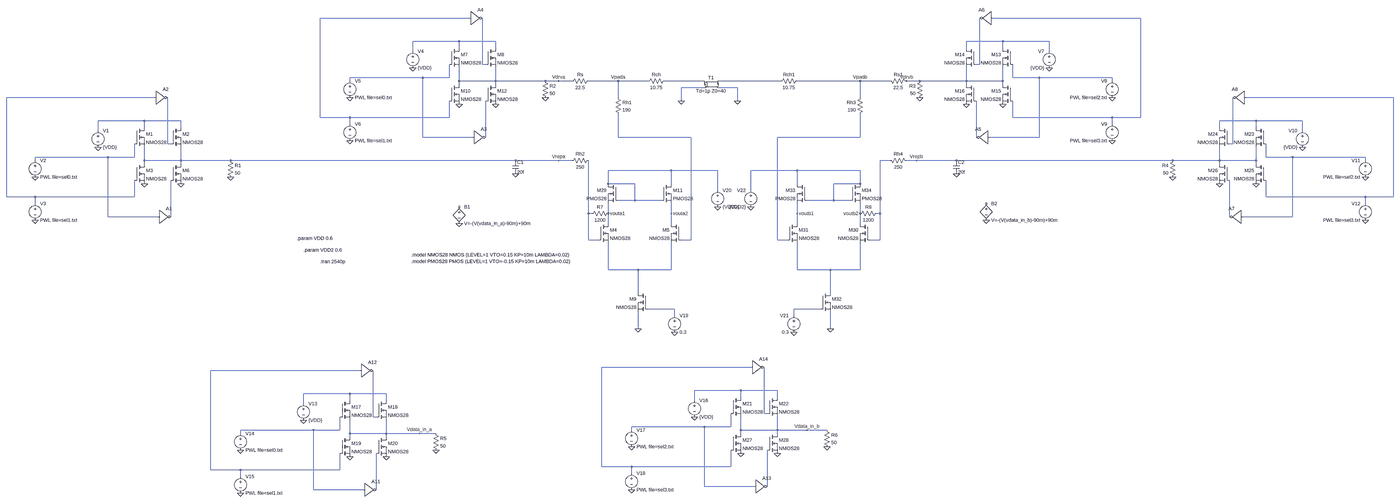
[diagram p0: schematic nvidia_pam3.asc, whole sheet]
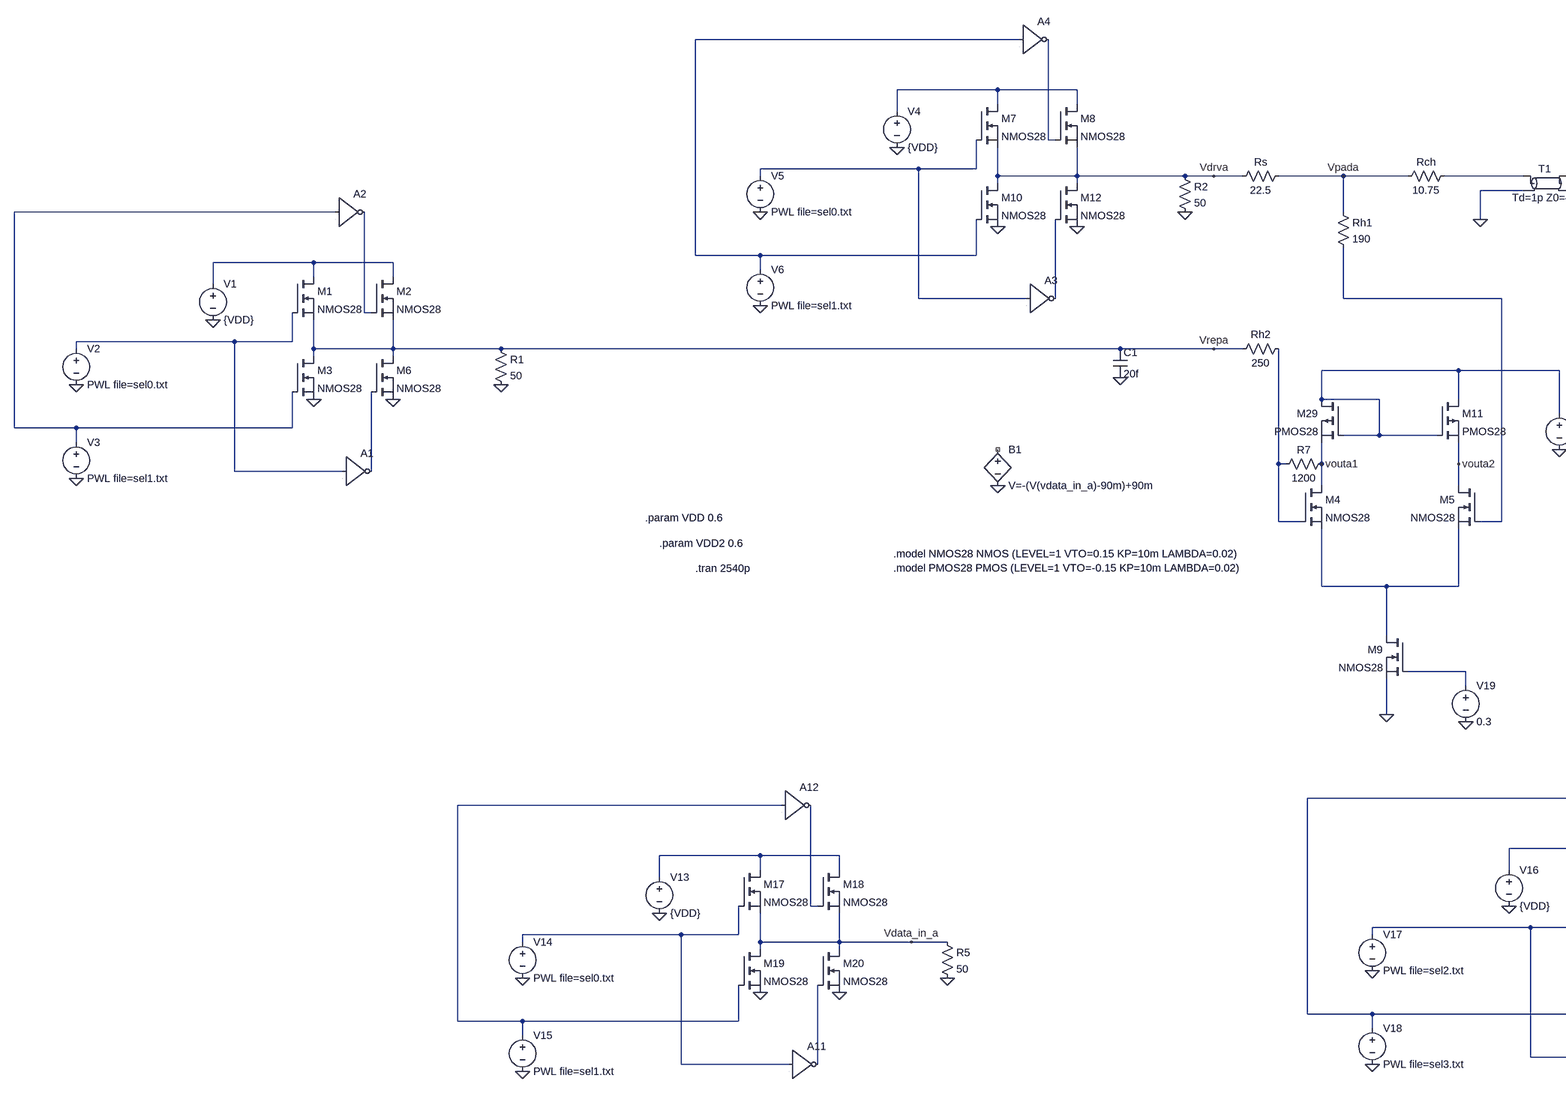
[diagram p1: schematic nvidia_pam3.asc, part, row 1 of 1, column 1 of 2]
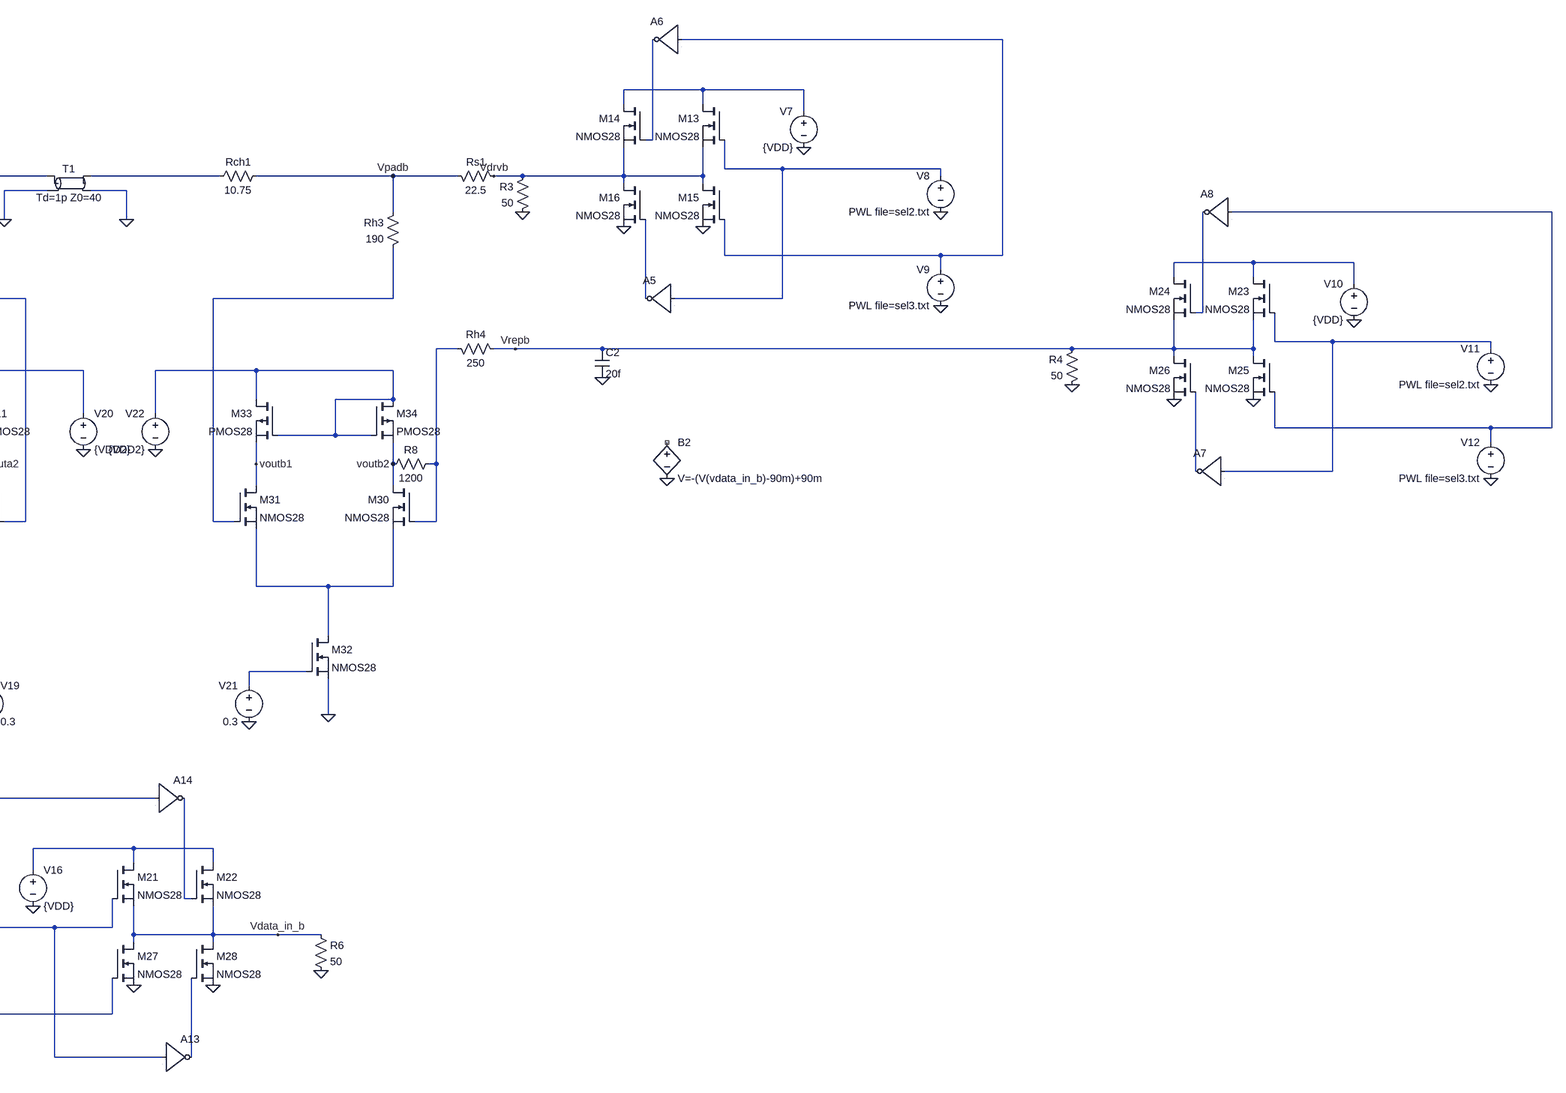
[diagram p2: schematic nvidia_pam3.asc, part, row 1 of 1, column 2 of 2]
nvidia_pam3.asc, the LTspice schematic file:
Version 4
SHEET 1 12048 3124
WIRE -176 -224 -896 -224
WIRE 3088 -224 2368 -224
WIRE -224 -112 -448 -112
WIRE -48 -112 -224 -112
WIRE 2416 -112 2240 -112
WIRE 2640 -112 2416 -112
WIRE -224 -80 -224 -112
WIRE -48 -80 -48 -112
WIRE 2240 -80 2240 -112
WIRE 2416 -80 2416 -112
WIRE -448 -64 -448 -112
WIRE 2640 -64 2640 -112
WIRE -112 0 -112 -224
WIRE -96 0 -112 0
WIRE 2304 0 2304 -224
WIRE 2304 0 2288 0
WIRE -400 64 -752 64
WIRE -272 64 -272 0
WIRE -272 64 -400 64
WIRE 2464 64 2464 0
WIRE 2592 64 2464 64
WIRE 2944 64 2592 64
WIRE -752 80 -752 64
WIRE -224 80 -224 16
WIRE -48 80 -48 16
WIRE -48 80 -224 80
WIRE 192 80 -48 80
WIRE 256 80 192 80
WIRE 320 80 256 80
WIRE 544 80 400 80
WIRE 688 80 544 80
WIRE 944 80 768 80
WIRE 1328 80 1040 80
WIRE 1712 80 1408 80
WIRE 1856 80 1712 80
WIRE 2000 80 1936 80
WIRE 2240 80 2240 16
WIRE 2240 80 2000 80
WIRE 2416 80 2416 16
WIRE 2416 80 2240 80
WIRE 2944 80 2944 64
WIRE -224 96 -224 80
WIRE -48 96 -48 80
WIRE 2240 96 2240 80
WIRE 2416 96 2416 80
WIRE 944 112 848 112
WIRE 1120 112 1040 112
WIRE -1696 160 -2416 160
WIRE 544 160 544 80
WIRE 1712 160 1712 80
WIRE 4624 160 3904 160
WIRE 848 176 848 112
WIRE 1120 176 1120 112
WIRE -896 256 -896 -224
WIRE -752 256 -896 256
WIRE -272 256 -272 176
WIRE -272 256 -752 256
WIRE 2464 256 2464 176
WIRE 2944 256 2464 256
WIRE 3088 256 3088 -224
WIRE 3088 256 2944 256
WIRE -1744 272 -1968 272
WIRE -1568 272 -1744 272
WIRE 3952 272 3776 272
WIRE 4176 272 3952 272
WIRE -752 288 -752 256
WIRE 2944 288 2944 256
WIRE -1744 304 -1744 272
WIRE -1568 304 -1568 272
WIRE 3776 304 3776 272
WIRE 3952 304 3952 272
WIRE -1968 320 -1968 272
WIRE 4176 320 4176 272
WIRE -400 352 -400 64
WIRE -160 352 -400 352
WIRE -96 352 -96 176
WIRE 544 352 544 240
WIRE 896 352 544 352
WIRE 1712 352 1712 240
WIRE 1712 352 1312 352
WIRE 2288 352 2288 176
WIRE 2592 352 2592 64
WIRE 2592 352 2352 352
WIRE -1632 384 -1632 160
WIRE -1616 384 -1632 384
WIRE 3840 384 3840 160
WIRE 3840 384 3824 384
WIRE -1920 448 -2272 448
WIRE -1792 448 -1792 384
WIRE -1792 448 -1920 448
WIRE 4000 448 4000 384
WIRE 4128 448 4000 448
WIRE 4480 448 4128 448
WIRE -2272 464 -2272 448
WIRE -1744 464 -1744 400
WIRE -1568 464 -1568 400
WIRE -1568 464 -1744 464
WIRE -1328 464 -1568 464
WIRE 48 464 -1328 464
WIRE 256 464 48 464
WIRE 320 464 256 464
WIRE 1856 464 1808 464
WIRE 1984 464 1936 464
WIRE 2192 464 1984 464
WIRE 3536 464 2192 464
WIRE 3776 464 3776 400
WIRE 3776 464 3536 464
WIRE 3952 464 3952 400
WIRE 3952 464 3776 464
WIRE 4480 464 4480 448
WIRE -1744 480 -1744 464
WIRE -1568 480 -1568 464
WIRE 3776 480 3776 464
WIRE 3952 480 3952 464
WIRE 800 512 496 512
WIRE 1024 512 800 512
WIRE 1408 512 1184 512
WIRE 1712 512 1408 512
WIRE 496 576 496 512
WIRE 624 576 496 576
WIRE 800 576 800 512
WIRE 1408 576 1408 512
WIRE 1712 576 1712 512
WIRE 1712 576 1584 576
WIRE 1024 608 1024 512
WIRE 1184 608 1184 512
WIRE -2416 640 -2416 160
WIRE -2272 640 -2416 640
WIRE -1792 640 -1792 560
WIRE -1792 640 -2272 640
WIRE 4000 640 4000 560
WIRE 4480 640 4000 640
WIRE 4624 640 4624 160
WIRE 4624 640 4480 640
WIRE 624 656 624 576
WIRE 624 656 544 656
WIRE 752 656 624 656
WIRE 1584 656 1584 576
WIRE 1584 656 1456 656
WIRE 1664 656 1584 656
WIRE -2272 672 -2272 640
WIRE 4480 672 4480 640
WIRE 400 720 400 464
WIRE 416 720 400 720
WIRE 496 720 496 672
WIRE 800 720 800 672
WIRE 1408 720 1408 672
WIRE 1712 720 1712 672
WIRE 1808 720 1808 464
WIRE 1808 720 1792 720
WIRE -1920 736 -1920 448
WIRE -1680 736 -1920 736
WIRE -1616 736 -1616 560
WIRE 3824 736 3824 560
WIRE 4128 736 4128 448
WIRE 4128 736 3888 736
WIRE 496 768 496 720
WIRE 800 768 800 720
WIRE 1408 768 1408 720
WIRE 1712 768 1712 720
WIRE 400 848 400 720
WIRE 448 848 400 848
WIRE 896 848 896 352
WIRE 896 848 848 848
WIRE 1312 848 1312 352
WIRE 1360 848 1312 848
WIRE 1808 848 1808 720
WIRE 1808 848 1760 848
WIRE 496 992 496 864
WIRE 640 992 496 992
WIRE 800 992 800 864
WIRE 800 992 640 992
WIRE 1408 992 1408 864
WIRE 1568 992 1408 992
WIRE 1712 992 1712 864
WIRE 1712 992 1568 992
WIRE 640 1168 640 992
WIRE 1568 1168 1568 992
WIRE 816 1248 688 1248
WIRE 1520 1248 1392 1248
WIRE 816 1280 816 1248
WIRE 1392 1280 1392 1248
WIRE 640 1344 640 1264
WIRE 1568 1344 1568 1264
WIRE 1184 1696 464 1696
WIRE -704 1712 -1424 1712
WIRE 1136 1808 912 1808
WIRE 1312 1808 1136 1808
WIRE -752 1824 -976 1824
WIRE -576 1824 -752 1824
WIRE 1136 1840 1136 1808
WIRE 1312 1840 1312 1808
WIRE -752 1856 -752 1824
WIRE -576 1856 -576 1824
WIRE 912 1856 912 1808
WIRE -976 1872 -976 1824
WIRE 1248 1920 1248 1696
WIRE 1264 1920 1248 1920
WIRE -640 1936 -640 1712
WIRE -624 1936 -640 1936
WIRE 960 1984 608 1984
WIRE 1088 1984 1088 1920
WIRE 1088 1984 960 1984
WIRE -928 2000 -1280 2000
WIRE -800 2000 -800 1936
WIRE -800 2000 -928 2000
WIRE 608 2000 608 1984
WIRE 1136 2000 1136 1936
WIRE 1312 2000 1312 1936
WIRE 1312 2000 1136 2000
WIRE 1456 2000 1312 2000
WIRE 1552 2000 1456 2000
WIRE -1280 2016 -1280 2000
WIRE -752 2016 -752 1952
WIRE -576 2016 -576 1952
WIRE -576 2016 -752 2016
WIRE -416 2016 -576 2016
WIRE -336 2016 -416 2016
WIRE 1136 2016 1136 2000
WIRE 1312 2016 1312 2000
WIRE -752 2032 -752 2016
WIRE -576 2032 -576 2016
WIRE 464 2176 464 1696
WIRE 608 2176 464 2176
WIRE 1088 2176 1088 2096
WIRE 1088 2176 608 2176
WIRE -1424 2192 -1424 1712
WIRE -1280 2192 -1424 2192
WIRE -800 2192 -800 2112
WIRE -800 2192 -1280 2192
WIRE 608 2208 608 2176
WIRE -1280 2224 -1280 2192
WIRE 960 2272 960 1984
WIRE 1200 2272 960 2272
WIRE 1264 2272 1264 2096
WIRE -928 2288 -928 2000
WIRE -688 2288 -928 2288
WIRE -624 2288 -624 2112
FLAG 848 176 0
FLAG 1120 176 0
FLAG 544 80 Vpada
FLAG 256 80 Vdrva
FLAG 256 464 Vrepa
FLAG 1984 464 Vrepb
FLAG 1712 80 Vpadb
FLAG 48 528 0
FLAG 2192 528 0
FLAG -1968 400 0
FLAG -1744 576 0
FLAG -1568 576 0
FLAG -2272 544 0
FLAG -2272 752 0
FLAG -1328 544 0
FLAG -448 16 0
FLAG -224 192 0
FLAG -48 192 0
FLAG -752 160 0
FLAG -752 368 0
FLAG 192 160 0
FLAG 1936 80 Vdrvb
FLAG 2640 16 0
FLAG 2416 192 0
FLAG 2240 192 0
FLAG 2944 160 0
FLAG 2944 368 0
FLAG 2000 160 0
FLAG 4176 400 0
FLAG 3952 576 0
FLAG 3776 576 0
FLAG 4480 544 0
FLAG 4480 752 0
FLAG 3536 544 0
FLAG -976 1952 0
FLAG -752 2128 0
FLAG -576 2128 0
FLAG -1280 2096 0
FLAG -1280 2304 0
FLAG -336 2096 0
FLAG 912 1936 0
FLAG 1136 2112 0
FLAG 1312 2112 0
FLAG 608 2080 0
FLAG 608 2288 0
FLAG 1552 2080 0
FLAG -416 2016 Vdata_in_a
FLAG 1456 2000 Vdata_in_b
FLAG 640 1344 0
FLAG 816 1360 0
FLAG 1024 688 0
FLAG 1568 1344 0
FLAG 1392 1360 0
FLAG 1184 688 0
FLAG 2336 752 0
FLAG -224 768 0
FLAG 496 720 vouta1
FLAG 800 720 vouta2
FLAG 1408 720 voutb1
FLAG 1712 720 voutb2
SYMBOL res 416 64 R90
WINDOW 0 0 56 VBottom 2
WINDOW 3 32 56 VTop 2
SYMATTR InstName Rs
SYMATTR Value 22.5
SYMBOL res 528 144 R0
SYMATTR InstName Rh1
SYMATTR Value 190
SYMBOL res 416 448 R90
WINDOW 0 0 56 VBottom 2
WINDOW 3 32 56 VTop 2
SYMATTR InstName Rh2
SYMATTR Value 250
SYMBOL res 784 64 R90
WINDOW 0 0 56 VBottom 2
WINDOW 3 32 56 VTop 2
SYMATTR InstName Rch
SYMATTR Value 10.75
SYMBOL tline 992 96 R0
SYMATTR InstName T1
SYMATTR Value Td=1p Z0=40
SYMBOL res 1840 64 M90
WINDOW 0 0 56 VBottom 2
WINDOW 3 32 56 VTop 2
SYMATTR InstName Rs1
SYMATTR Value 22.5
SYMBOL res 1728 144 M0
SYMATTR InstName Rh3
SYMATTR Value 190
SYMBOL res 1840 448 M90
WINDOW 0 0 56 VBottom 2
WINDOW 3 32 56 VTop 2
SYMATTR InstName Rh4
SYMATTR Value 250
SYMBOL res 1424 64 R90
WINDOW 0 0 56 VBottom 2
WINDOW 3 32 56 VTop 2
SYMATTR InstName Rch1
SYMATTR Value 10.75
SYMBOL cap 32 464 R0
SYMATTR InstName C1
SYMATTR Value 20f
SYMBOL cap 2176 464 R0
SYMATTR InstName C2
SYMATTR Value 20f
SYMBOL voltage -1968 304 R0
WINDOW 123 0 0 Left 0
WINDOW 39 0 0 Left 0
SYMATTR InstName V1
SYMATTR Value {VDD}
SYMBOL nmos -1792 304 R0
SYMATTR InstName M1
SYMATTR Value NMOS28
SYMBOL nmos -1616 304 R0
SYMATTR InstName M2
SYMATTR Value NMOS28
SYMBOL nmos -1792 480 R0
SYMATTR InstName M3
SYMATTR Value NMOS28
SYMBOL nmos -1616 480 R0
SYMATTR InstName M6
SYMATTR Value NMOS28
SYMBOL voltage -2272 448 R0
WINDOW 123 0 0 Left 0
WINDOW 39 0 0 Left 0
SYMATTR InstName V2
SYMATTR Value PWL file=sel0.txt
SYMBOL voltage -2272 656 R0
WINDOW 123 0 0 Left 0
WINDOW 39 0 0 Left 0
SYMATTR InstName V3
SYMATTR Value PWL file=sel1.txt
SYMBOL res -1344 448 R0
SYMATTR InstName R1
SYMATTR Value 50
SYMBOL Digital\\inv -1680 672 R0
SYMATTR InstName A1
SYMBOL Digital\\inv -1696 96 R0
SYMATTR InstName A2
SYMBOL voltage -448 -80 R0
WINDOW 123 0 0 Left 0
WINDOW 39 0 0 Left 0
SYMATTR InstName V4
SYMATTR Value {VDD}
SYMBOL nmos -272 -80 R0
SYMATTR InstName M7
SYMATTR Value NMOS28
SYMBOL nmos -96 -80 R0
SYMATTR InstName M8
SYMATTR Value NMOS28
SYMBOL nmos -272 96 R0
SYMATTR InstName M10
SYMATTR Value NMOS28
SYMBOL nmos -96 96 R0
SYMATTR InstName M12
SYMATTR Value NMOS28
SYMBOL voltage -752 64 R0
WINDOW 123 0 0 Left 0
WINDOW 39 0 0 Left 0
SYMATTR InstName V5
SYMATTR Value PWL file=sel0.txt
SYMBOL voltage -752 272 R0
WINDOW 123 0 0 Left 0
WINDOW 39 0 0 Left 0
SYMATTR InstName V6
SYMATTR Value PWL file=sel1.txt
SYMBOL res 176 64 R0
SYMATTR InstName R2
SYMATTR Value 50
SYMBOL Digital\\inv -160 288 R0
SYMATTR InstName A3
SYMBOL Digital\\inv -176 -288 R0
SYMATTR InstName A4
SYMBOL voltage 2640 -80 M0
WINDOW 123 0 0 Left 0
WINDOW 39 0 0 Left 0
SYMATTR InstName V7
SYMATTR Value {VDD}
SYMBOL nmos 2464 -80 M0
SYMATTR InstName M13
SYMATTR Value NMOS28
SYMBOL nmos 2288 -80 M0
SYMATTR InstName M14
SYMATTR Value NMOS28
SYMBOL nmos 2464 96 M0
SYMATTR InstName M15
SYMATTR Value NMOS28
SYMBOL nmos 2288 96 M0
SYMATTR InstName M16
SYMATTR Value NMOS28
SYMBOL voltage 2944 64 M0
WINDOW 123 0 0 Left 0
WINDOW 39 0 0 Left 0
SYMATTR InstName V8
SYMATTR Value PWL file=sel2.txt
SYMBOL voltage 2944 272 M0
WINDOW 123 0 0 Left 0
WINDOW 39 0 0 Left 0
SYMATTR InstName V9
SYMATTR Value PWL file=sel3.txt
SYMBOL res 2016 64 M0
SYMATTR InstName R3
SYMATTR Value 50
SYMBOL Digital\\inv 2352 288 M0
SYMATTR InstName A5
SYMBOL Digital\\inv 2368 -288 M0
SYMATTR InstName A6
SYMBOL voltage 4176 304 M0
WINDOW 123 0 0 Left 0
WINDOW 39 0 0 Left 0
SYMATTR InstName V10
SYMATTR Value {VDD}
SYMBOL nmos 4000 304 M0
SYMATTR InstName M23
SYMATTR Value NMOS28
SYMBOL nmos 3824 304 M0
SYMATTR InstName M24
SYMATTR Value NMOS28
SYMBOL nmos 4000 480 M0
SYMATTR InstName M25
SYMATTR Value NMOS28
SYMBOL nmos 3824 480 M0
SYMATTR InstName M26
SYMATTR Value NMOS28
SYMBOL voltage 4480 448 M0
WINDOW 123 0 0 Left 0
WINDOW 39 0 0 Left 0
SYMATTR InstName V11
SYMATTR Value PWL file=sel2.txt
SYMBOL voltage 4480 656 M0
WINDOW 123 0 0 Left 0
WINDOW 39 0 0 Left 0
SYMATTR InstName V12
SYMATTR Value PWL file=sel3.txt
SYMBOL res 3552 448 M0
SYMATTR InstName R4
SYMATTR Value 50
SYMBOL Digital\\inv 3888 672 M0
SYMATTR InstName A7
SYMBOL Digital\\inv 3904 96 M0
SYMATTR InstName A8
SYMBOL voltage -976 1856 R0
WINDOW 123 0 0 Left 0
WINDOW 39 0 0 Left 0
SYMATTR InstName V13
SYMATTR Value {VDD}
SYMBOL nmos -800 1856 R0
SYMATTR InstName M17
SYMATTR Value NMOS28
SYMBOL nmos -624 1856 R0
SYMATTR InstName M18
SYMATTR Value NMOS28
SYMBOL nmos -800 2032 R0
SYMATTR InstName M19
SYMATTR Value NMOS28
SYMBOL nmos -624 2032 R0
SYMATTR InstName M20
SYMATTR Value NMOS28
SYMBOL voltage -1280 2000 R0
WINDOW 123 0 0 Left 0
WINDOW 39 0 0 Left 0
SYMATTR InstName V14
SYMATTR Value PWL file=sel0.txt
SYMBOL voltage -1280 2208 R0
WINDOW 123 0 0 Left 0
WINDOW 39 0 0 Left 0
SYMATTR InstName V15
SYMATTR Value PWL file=sel1.txt
SYMBOL res -352 2000 R0
SYMATTR InstName R5
SYMATTR Value 50
SYMBOL Digital\\inv -688 2224 R0
SYMATTR InstName A11
SYMBOL Digital\\inv -704 1648 R0
SYMATTR InstName A12
SYMBOL voltage 912 1840 R0
WINDOW 123 0 0 Left 0
WINDOW 39 0 0 Left 0
SYMATTR InstName V16
SYMATTR Value {VDD}
SYMBOL nmos 1088 1840 R0
SYMATTR InstName M21
SYMATTR Value NMOS28
SYMBOL nmos 1264 1840 R0
SYMATTR InstName M22
SYMATTR Value NMOS28
SYMBOL nmos 1088 2016 R0
SYMATTR InstName M27
SYMATTR Value NMOS28
SYMBOL nmos 1264 2016 R0
SYMATTR InstName M28
SYMATTR Value NMOS28
SYMBOL voltage 608 1984 R0
WINDOW 123 0 0 Left 0
WINDOW 39 0 0 Left 0
SYMATTR InstName V17
SYMATTR Value PWL file=sel2.txt
SYMBOL voltage 608 2192 R0
WINDOW 123 0 0 Left 0
WINDOW 39 0 0 Left 0
SYMATTR InstName V18
SYMATTR Value PWL file=sel3.txt
SYMBOL res 1536 1984 R0
SYMATTR InstName R6
SYMATTR Value 50
SYMBOL Digital\\inv 1200 2208 R0
SYMATTR InstName A13
SYMBOL Digital\\inv 1184 1632 R0
SYMATTR InstName A14
SYMBOL voltage 816 1264 R0
WINDOW 123 0 0 Left 0
WINDOW 39 0 0 Left 0
SYMATTR InstName V19
SYMATTR Value 0.3
SYMBOL nmos 448 768 R0
SYMATTR InstName M4
SYMATTR Value NMOS28
SYMBOL nmos 848 768 M0
SYMATTR InstName M5
SYMATTR Value NMOS28
SYMBOL nmos 688 1168 M0
SYMATTR InstName M9
SYMATTR Value NMOS28
SYMBOL pmos 752 576 R0
SYMATTR InstName M11
SYMATTR Value PMOS28
SYMBOL pmos 544 576 M0
SYMATTR InstName M29
SYMATTR Value PMOS28
SYMBOL voltage 1024 592 R0
WINDOW 123 0 0 Left 0
WINDOW 39 0 0 Left 0
SYMATTR InstName V20
SYMATTR Value {VDD2}
SYMBOL voltage 1392 1264 M0
WINDOW 123 0 0 Left 0
WINDOW 39 0 0 Left 0
SYMATTR InstName V21
SYMATTR Value 0.3
SYMBOL nmos 1760 768 M0
SYMATTR InstName M30
SYMATTR Value NMOS28
SYMBOL nmos 1360 768 R0
SYMATTR InstName M31
SYMATTR Value NMOS28
SYMBOL nmos 1520 1168 R0
SYMATTR InstName M32
SYMATTR Value NMOS28
SYMBOL pmos 1456 576 M0
SYMATTR InstName M33
SYMATTR Value PMOS28
SYMBOL pmos 1664 576 R0
SYMATTR InstName M34
SYMATTR Value PMOS28
SYMBOL voltage 1184 592 M0
WINDOW 123 0 0 Left 0
WINDOW 39 0 0 Left 0
SYMATTR InstName V22
SYMATTR Value {VDD2}
SYMBOL res 512 704 R90
WINDOW 0 0 56 VBottom 2
WINDOW 3 32 56 VTop 2
SYMATTR InstName R7
SYMATTR Value 1200
SYMBOL res 1808 704 R90
WINDOW 0 0 56 VBottom 2
WINDOW 3 32 56 VTop 2
SYMATTR InstName R8
SYMATTR Value 1200
SYMBOL bv -224 672 R0
SYMATTR InstName B1
SYMATTR Value V=-(V(vdata_in_a)-90m)+90m
SYMBOL bv 2336 656 R0
SYMATTR InstName B2
SYMATTR Value V=-(V(vdata_in_b)-90m)+90m
TEXT -896 952 Left 2 !.tran 2540p
TEXT -456 920 Left 2 !.model NMOS28 NMOS (LEVEL=1 VTO=0.15 KP=10m LAMBDA=0.02)\n.model PMOS28 PMOS (LEVEL=1 VTO=-0.15 KP=10m LAMBDA=0.02)
TEXT -1008 840 Left 2 !.param VDD 0.6
TEXT -976 896 Left 2 !.param VDD2 0.6

The netlist it stands for:
* nvidia_pam3.asc
Rs Vpada Vdrva 22.5
Rh1 Vpada N016 190
Rh2 N026 Vrepa 250
Rch N009 Vpada 10.75
T1 N009 0 N010 0 Td=1p Z0=40
Rs1 Vpadb Vdrvb 22.5
Rh3 Vpadb N017 190
Rh4 N023 Vrepb 250
Rch1 Vpadb N010 10.75
C1 Vrepa 0 20f
C2 Vrepb 0 20f
V1 N013 0 {VDD}
M1 N013 N021 Vrepa Vrepa NMOS28
M2 N013 N019 Vrepa Vrepa NMOS28
M3 Vrepa N011 0 0 NMOS28
M6 Vrepa N027 0 0 NMOS28
V2 N021 0 PWL file=sel0.txt
V3 N011 0 PWL file=sel1.txt
R1 Vrepa 0 50
A1 N021 0 0 0 0 N027 0 0 BUF
A2 N011 0 0 0 0 N019 0 0 BUF
V4 N003 0 {VDD}
M7 N003 N007 Vdrva Vdrva NMOS28
M8 N003 N005 Vdrva Vdrva NMOS28
M10 Vdrva N001 0 0 NMOS28
M12 Vdrva N015 0 0 NMOS28
V5 N007 0 PWL file=sel0.txt
V6 N001 0 PWL file=sel1.txt
R2 Vdrva 0 50
A3 N007 0 0 0 0 N015 0 0 BUF
A4 N001 0 0 0 0 N005 0 0 BUF
V7 N004 0 {VDD}
M13 N004 N008 Vdrvb Vdrvb NMOS28
M14 N004 N006 Vdrvb Vdrvb NMOS28
M15 Vdrvb N002 0 0 NMOS28
M16 Vdrvb N018 0 0 NMOS28
V8 N008 0 PWL file=sel2.txt
V9 N002 0 PWL file=sel3.txt
R3 Vdrvb 0 50
A5 N008 0 0 0 0 N018 0 0 BUF
A6 N002 0 0 0 0 N006 0 0 BUF
V10 N014 0 {VDD}
M23 N014 N022 Vrepb Vrepb NMOS28
M24 N014 N020 Vrepb Vrepb NMOS28
M25 Vrepb N012 0 0 NMOS28
M26 Vrepb N028 0 0 NMOS28
V11 N022 0 PWL file=sel2.txt
V12 N012 0 PWL file=sel3.txt
R4 Vrepb 0 50
A7 N022 0 0 0 0 N028 0 0 BUF
A8 N012 0 0 0 0 N020 0 0 BUF
V13 N036 0 {VDD}
M17 N036 N040 Vdata_in_a Vdata_in_a NMOS28
M18 N036 N038 Vdata_in_a Vdata_in_a NMOS28
M19 Vdata_in_a N034 0 0 NMOS28
M20 Vdata_in_a N042 0 0 NMOS28
V14 N040 0 PWL file=sel0.txt
V15 N034 0 PWL file=sel1.txt
R5 Vdata_in_a 0 50
A11 N040 0 0 0 0 N042 0 0 BUF
A12 N034 0 0 0 0 N038 0 0 BUF
V16 N035 0 {VDD}
M21 N035 N039 Vdata_in_b Vdata_in_b NMOS28
M22 N035 N037 Vdata_in_b Vdata_in_b NMOS28
M27 Vdata_in_b N033 0 0 NMOS28
M28 Vdata_in_b N041 0 0 NMOS28
V17 N039 0 PWL file=sel2.txt
V18 N033 0 PWL file=sel3.txt
R6 Vdata_in_b 0 50
A13 N039 0 0 0 0 N041 0 0 BUF
A14 N033 0 0 0 0 N037 0 0 BUF
V19 N031 0 0.3
M4 vouta1 N026 N029 N029 NMOS28
M5 vouta2 N016 N029 N029 NMOS28
M9 N029 N031 0 0 NMOS28
M11 N024 N024 vouta2 vouta2 PMOS28
M29 N024 N024 vouta1 vouta1 PMOS28
V20 N024 0 {VDD2}
V21 N032 0 0.3
M30 voutb2 N023 N030 N030 NMOS28
M31 voutb1 N017 N030 N030 NMOS28
M32 N030 N032 0 0 NMOS28
M33 N025 N025 voutb1 voutb1 PMOS28
M34 N025 N025 voutb2 voutb2 PMOS28
V22 N025 0 {VDD2}
R7 vouta1 N026 1200
R8 N023 voutb2 1200
B1 NC_01 0 V=-(V(vdata_in_a)-90m)+90m
B2 NC_02 0 V=-(V(vdata_in_b)-90m)+90m
.model NMOS NMOS
.model PMOS PMOS
.lib standard.mos
.tran 2540p
.model NMOS28 NMOS (LEVEL=1 VTO=0.15 KP=10m LAMBDA=0.02)
.model PMOS28 PMOS (LEVEL=1 VTO=-0.15 KP=10m LAMBDA=0.02)
.param VDD 0.6
.param VDD2 0.6
.backanno
.end